# EAGLE design ecocar_CVM (EAGLE 7.7.0)
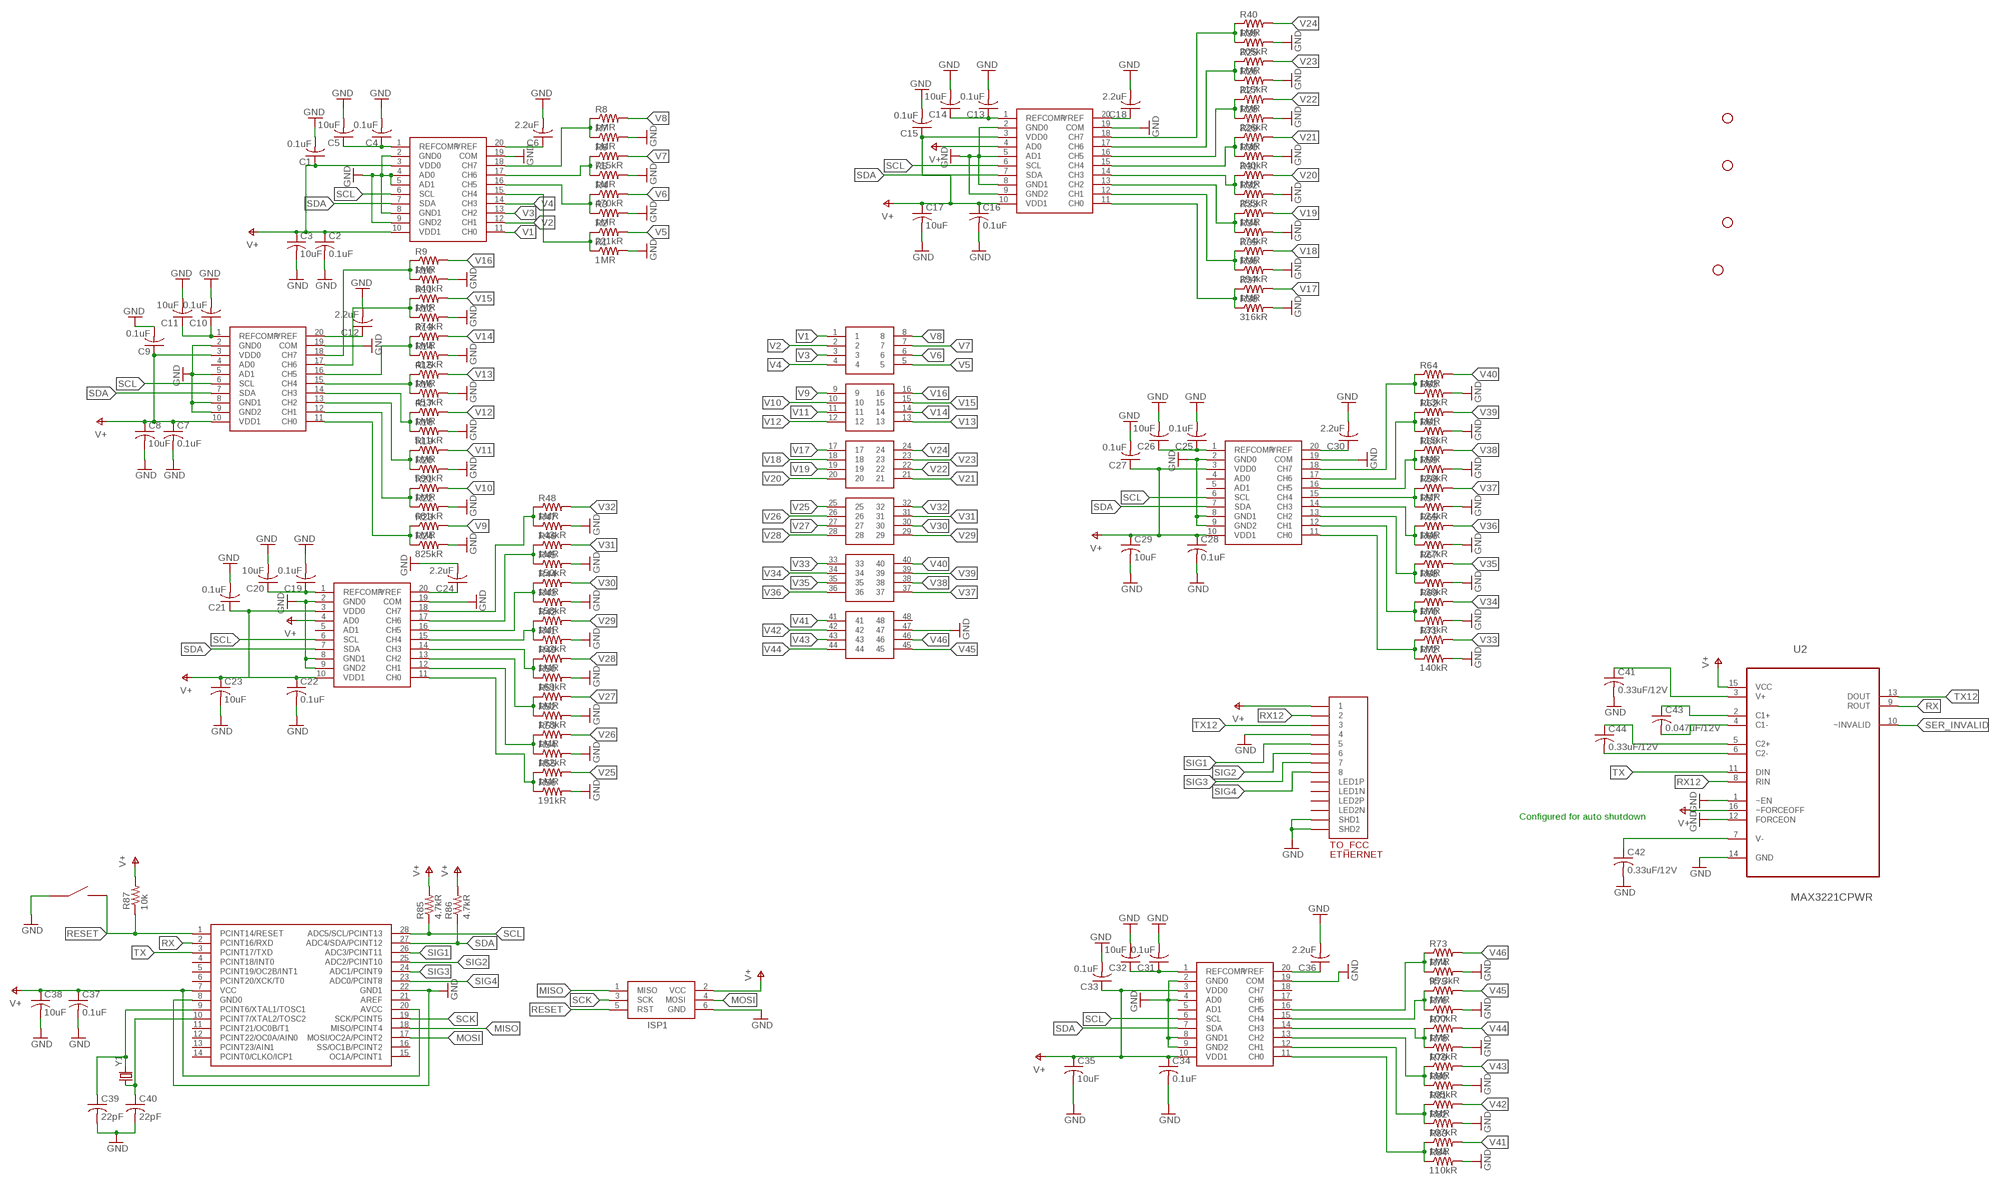
[diagram p0: schematic, sheet 1]

## Parts
0001000  LTC2309  LTC2309HF#PBF  [TSSOP20]
0001001  LTC2309  LTC2309HF#PBF  [TSSOP20]
0001010  LTC2309  LTC2309HF#PBF  [TSSOP20]
0001011  LTC2309  LTC2309HF#PBF  [TSSOP20]
0011000  LTC2309  LTC2309HF#PBF  [TSSOP20]
0011001  LTC2309  LTC2309HF#PBF  [TSSOP20]
C1  0.1uF  C-USC0805  [C0805]
C2  0.1uF  C-USC0805  [C0805]
C3  10uF  C-USC0805  [C0805]
C4  0.1uF  C-USC0805  [C0805]
C5  10uF  C-USC0805  [C0805]
C6  2.2uF  C-USC0805  [C0805]
C7  0.1uF  C-USC0805  [C0805]
C8  10uF  C-USC0805  [C0805]
C9  0.1uF  C-USC0805  [C0805]
C10  0.1uF  C-USC0805  [C0805]
C11  10uF  C-USC0805  [C0805]
C12  2.2uF  C-USC0805  [C0805]
C13  0.1uF  C-USC0805  [C0805]
C14  10uF  C-USC0805  [C0805]
C15  0.1uF  C-USC0805  [C0805]
C16  0.1uF  C-USC0805  [C0805]
C17  10uF  C-USC0805  [C0805]
C18  2.2uF  C-USC0805  [C0805]
C19  0.1uF  C-USC0805  [C0805]
C20  10uF  C-USC0805  [C0805]
C21  0.1uF  C-USC0805  [C0805]
C22  0.1uF  C-USC0805  [C0805]
C23  10uF  C-USC0805  [C0805]
C24  2.2uF  C-USC0805  [C0805]
C25  0.1uF  C-USC0805  [C0805]
C26  10uF  C-USC0805  [C0805]
C27  0.1uF  C-USC0805  [C0805]
C28  0.1uF  C-USC0805  [C0805]
C29  10uF  C-USC0805  [C0805]
C30  2.2uF  C-USC0805  [C0805]
C31  0.1uF  C-USC0805  [C0805]
C32  10uF  C-USC0805  [C0805]
C33  0.1uF  C-USC0805  [C0805]
C34  0.1uF  C-USC0805  [C0805]
C35  10uF  C-USC0805  [C0805]
C36  2.2uF  C-USC0805  [C0805]
C37  0.1uF  C-USC0805  [C0805]
C38  10uF  C-USC0805  [C0805]
C39  22pF  C-USC0805  [C0805]
C40  22pF  C-USC0805  [C0805]
C41  0.33uF/12V  C-USC0805  [C0805]
C42  0.33uF/12V  C-USC0805  [C0805]
C43  0.047uF/12V  C-USC0805  [C0805]
C44  0.33uF/12V  C-USC0805  [C0805]
ISP1  AVRISP-BOX  [AVRISP-BOX]
R1  1MR  R-US_R0805  [R0805]
R2  221kR  R-US_R0805  [R0805]
R3  1MR  R-US_R0805  [R0805]
R4  470kR  R-US_R0805  [R0805]
R5  1MR  R-US_R0805  [R0805]
R6  715kR  R-US_R0805  [R0805]
R7  1MR  R-US_R0805  [R0805]
R8  1MR  R-US_R0805  [R0805]
R9  1MR  R-US_R0805  [R0805]
R10  340kR  R-US_R0805  [R0805]
R11  1MR  R-US_R0805  [R0805]
R12  374kR  R-US_R0805  [R0805]
R13  1MR  R-US_R0805  [R0805]
R14  412kR  R-US_R0805  [R0805]
R15  1MR  R-US_R0805  [R0805]
R16  453kR  R-US_R0805  [R0805]
R17  1MR  R-US_R0805  [R0805]
R18  511kR  R-US_R0805  [R0805]
R19  1MR  R-US_R0805  [R0805]
R20  590kR  R-US_R0805  [R0805]
R21  1MR  R-US_R0805  [R0805]
R22  681kR  R-US_R0805  [R0805]
R23  1MR  R-US_R0805  [R0805]
R24  825kR  R-US_R0805  [R0805]
R25  1MR  R-US_R0805  [R0805]
R26  215kR  R-US_R0805  [R0805]
R27  1MR  R-US_R0805  [R0805]
R28  226kR  R-US_R0805  [R0805]
R29  1MR  R-US_R0805  [R0805]
R30  240kR  R-US_R0805  [R0805]
R31  1MR  R-US_R0805  [R0805]
R32  255kR  R-US_R0805  [R0805]
R33  1MR  R-US_R0805  [R0805]
R34  274kR  R-US_R0805  [R0805]
R35  1MR  R-US_R0805  [R0805]
R36  294kR  R-US_R0805  [R0805]
R37  1MR  R-US_R0805  [R0805]
R38  316kR  R-US_R0805  [R0805]
R39  205kR  R-US_R0805  [R0805]
R40  1MR  R-US_R0805  [R0805]
R41  162kR  R-US_R0805  [R0805]
R42  1MR  R-US_R0805  [R0805]
R43  158kR  R-US_R0805  [R0805]
R44  1MR  R-US_R0805  [R0805]
R45  150kR  R-US_R0805  [R0805]
R46  1MR  R-US_R0805  [R0805]
R47  143kR  R-US_R0805  [R0805]
R48  1MR  R-US_R0805  [R0805]
R49  1MR  R-US_R0805  [R0805]
R50  169kR  R-US_R0805  [R0805]
R51  1MR  R-US_R0805  [R0805]
R52  178kR  R-US_R0805  [R0805]
R53  1MR  R-US_R0805  [R0805]
R54  182kR  R-US_R0805  [R0805]
R55  1MR  R-US_R0805  [R0805]
R56  191kR  R-US_R0805  [R0805]
R57  124kR  R-US_R0805  [R0805]
R58  1MR  R-US_R0805  [R0805]
R59  120kR  R-US_R0805  [R0805]
R60  1MR  R-US_R0805  [R0805]
R61  115kR  R-US_R0805  [R0805]
R62  1MR  R-US_R0805  [R0805]
R63  113kR  R-US_R0805  [R0805]
R64  1MR  R-US_R0805  [R0805]
R65  1MR  R-US_R0805  [R0805]
R66  127kR  R-US_R0805  [R0805]
R67  1MR  R-US_R0805  [R0805]
R68  130kR  R-US_R0805  [R0805]
R69  1MR  R-US_R0805  [R0805]
R70  133kR  R-US_R0805  [R0805]
R71  1MR  R-US_R0805  [R0805]
R72  140kR  R-US_R0805  [R0805]
R73  1MR  R-US_R0805  [R0805]
R74  95.3kR  R-US_R0805  [R0805]
R75  1MR  R-US_R0805  [R0805]
R76  100kR  R-US_R0805  [R0805]
R77  1MR  R-US_R0805  [R0805]
R78  102kR  R-US_R0805  [R0805]
R79  1MR  R-US_R0805  [R0805]
R80  105kR  R-US_R0805  [R0805]
R81  1MR  R-US_R0805  [R0805]
R82  107kR  R-US_R0805  [R0805]
R83  1MR  R-US_R0805  [R0805]
R84  110kR  R-US_R0805  [R0805]
R85  4.7kR  R-US_R0805  [R0805]
R86  4.7kR  R-US_R0805  [R0805]
R87  10k  R-US_R0805  [R0805]
STANDOFF1  STAND-OFF  [STAND-OFF]
STANDOFF2  STAND-OFF  [STAND-OFF]
STANDOFF3  STAND-OFF  [STAND-OFF]
STANDOFF4  STAND-OFF  [STAND-OFF]
TO_FCC  ETHERNET  [A122645-ND]
U2  MAX3221CPWR  [SOP65P640X120-16N]
U$1  ATMEGA328P  [DIL28-3]
U$3  6-RJ45  6-RJ45-5557572-3  [48-PIN-THROUGHHOLE]
U$4  EG4621CT-ND  [EG4621CT-ND]
Y1  CRYSTALHC49US  [HC49US]

## Nets
GND: 0001000.2(GND0) 0001000.4(AD0) 0001000.5(AD1) 0001000.8(GND1) 0001000.9(GND2) 0001000.19(COM) 0001001.2(GND0) 0001001.5(AD1) 0001001.8(GND1) 0001001.9(GND2) 0001001.19(COM) 0001010.2(GND0) 0001010.5(AD1) 0001010.8(GND1) 0001010.9(GND2) 0001010.19(COM) 0001011.2(GND0) 0001011.8(GND1) 0001011.9(GND2) 0001011.19(COM) 0011000.2(GND0) 0011000.8(GND1) 0011000.9(GND2) 0011000.19(COM) 0011001.2(GND0) 0011001.4(AD0) 0011001.8(GND1) 0011001.9(GND2) 0011001.19(COM) C1.2 C2.2 C3.2 C4.2 C5.2 C6.2 C7.2 C8.2 C9.2 C10.2 C11.2 C12.2 C13.2 C14.2 C15.2 C16.2 C17.2 C18.2 C19.2 C20.2 C21.2 C22.2 C23.2 C24.2 C25.2 C26.2 C27.2 C28.2 C29.2 C30.2 C31.2 C32.2 C33.2 C34.2 C35.2 C36.2 C37.2 C38.2 C39.2 C40.2 C41.2 C42.2 ISP1.6(GND) R1.2 R3.2 R5.2 R7.2 R10.2 R12.2 R14.2 R16.2 R18.2 R20.2 R22.2 R24.2 R26.2 R28.2 R30.2 R32.2 R34.2 R36.2 R38.2 R39.2 R41.2 R43.2 R45.2 R47.2 R50.2 R52.2 R54.2 R56.2 R57.2 R59.2 R61.2 R63.2 R66.2 R68.2 R70.2 R72.2 R74.2 R76.2 R78.2 R80.2 R82.2 R84.2 TO_FCC.P$4 TO_FCC.P$13(SHD1) TO_FCC.P$14(SHD2) U2.1(~EN) U2.12(FORCEON) U2.14(GND) U$1.8(GND0) U$1.22(GND1) U$3.47 U$4.P$1 U$4.P$2
MISO: ISP1.1(MISO) U$1.18(MISO/PCINT4)
MOSI: ISP1.4(MOSI) U$1.17(MOSI/OC2A/PCINT2)
N$1: 0001000.1(REFCOMP) C4.1 C5.1
N$2: 0001000.20(VREF) C6.1
N$3: 0001001.11(CH0) R23.1 R24.1
N$4: 0001001.1(REFCOMP) C10.1 C11.1
N$5: 0001001.20(VREF) C12.1
N$6: 0001001.12(CH1) R21.1 R22.1
N$7: 0001000.15(CH4) R1.1 R2.1
N$8: 0001000.16(CH5) R3.1 R4.1
N$9: 0001000.17(CH6) R5.1 R6.1
N$10: 0001000.18(CH7) R7.1 R8.1
N$11: 0001001.13(CH2) R19.1 R20.1
N$12: 0001001.14(CH3) R17.1 R18.1
N$13: 0001001.15(CH4) R15.1 R16.1
N$14: 0001001.16(CH5) R13.1 R14.1
N$15: 0001001.17(CH6) R11.1 R12.1
N$16: 0001001.18(CH7) R9.1 R10.1
N$17: 0001010.1(REFCOMP) C13.1 C14.1
N$18: 0011000.1(REFCOMP) C25.1 C26.1
N$19: 0001010.11(CH0) R37.1 R38.1
N$20: 0001010.20(VREF) C18.1
N$21: 0001010.12(CH1) R35.1 R36.1
N$22: 0001010.13(CH2) R33.1 R34.1
N$23: 0001010.14(CH3) R31.1 R32.1
N$24: 0001010.15(CH4) R29.1 R30.1
N$25: 0001010.16(CH5) R27.1 R28.1
N$26: 0001010.17(CH6) R25.1 R26.1
N$27: 0001010.18(CH7) R39.1 R40.1
N$28: 0001011.1(REFCOMP) C19.1 C20.1
N$29: 0011001.1(REFCOMP) C31.1 C32.1
N$30: 0011001.20(VREF) C36.1
N$31: 0001011.20(VREF) C24.1
N$32: 0001011.11(CH0) R55.1 R56.1
N$33: 0001011.12(CH1) R53.1 R54.1
N$34: 0001011.13(CH2) R51.1 R52.1
N$35: 0001011.14(CH3) R49.1 R50.1
N$36: 0001011.15(CH4) R41.1 R42.1
N$37: 0001011.16(CH5) R43.1 R44.1
N$38: 0001011.17(CH6) R45.1 R46.1
N$39: 0001011.18(CH7) R47.1 R48.1
N$40: 0011000.20(VREF) C30.1
N$41: 0011000.11(CH0) R71.1 R72.1
N$42: 0011000.12(CH1) R69.1 R70.1
N$43: 0011000.13(CH2) R67.1 R68.1
N$44: 0011000.14(CH3) R65.1 R66.1
N$45: 0011000.15(CH4) R57.1 R58.1
N$46: 0011000.16(CH5) R59.1 R60.1
N$47: 0011000.17(CH6) R61.1 R62.1
N$48: 0011000.18(CH7) R63.1 R64.1
N$49: C39.1 U$1.9(PCINT6/XTAL1/TOSC1) Y1.2
N$50: C40.1 U$1.10(PCINT7/XTAL2/TOSC2) Y1.1
N$51: 0011001.11(CH0) R83.1 R84.1
N$52: 0011001.12(CH1) R81.1 R82.1
N$53: 0011001.13(CH2) R79.1 R80.1
N$54: 0011001.14(CH3) R77.1 R78.1
N$55: 0011001.15(CH4) R75.1 R76.1
N$56: 0011001.16(CH5) R73.1 R74.1
N$73: C41.1 U2.3(V+)
N$74: C43.1 U2.2(C1+)
N$75: C43.2 U2.4(C1-)
N$76: C44.1 U2.5(C2+)
N$77: C44.2 U2.6(C2-)
N$78: C42.1 U2.7(V-)
RESET: ISP1.5(RST) R87.1 U$1.1(PCINT14/RESET) U$4.P$3 U$4.P$4
RX: U2.9(ROUT) U$1.2(PCINT16/RXD)
RX12: TO_FCC.P$2 U2.8(RIN)
SCK: ISP1.3(SCK) U$1.19(SCK/PCINT5)
SCL: 0001000.6(SCL) 0001001.6(SCL) 0001010.6(SCL) 0001011.6(SCL) 0011000.6(SCL) 0011001.6(SCL) R85.1 U$1.28(ADC5/SCL/PCINT13)
SDA: 0001000.7(SDA) 0001001.7(SDA) 0001010.7(SDA) 0001011.7(SDA) 0011000.7(SDA) 0011001.7(SDA) R86.1 U$1.27(ADC4/SDA/PCINT12)
SER_INVALID: U2.10(~INVALID)
SIG1: TO_FCC.P$5 U$1.26(ADC3/PCINT11)
SIG2: TO_FCC.P$6 U$1.25(ADC2/PCINT10)
SIG3: TO_FCC.P$7 U$1.24(ADC1/PCINT9)
SIG4: TO_FCC.P$8 U$1.23(ADC0/PCINT8)
TX: U2.11(DIN) U$1.3(PCINT17/TXD)
TX12: TO_FCC.P$3 U2.13(DOUT)
V1: 0001000.11(CH0) U$3.1
V2: 0001000.12(CH1) U$3.2
V3: 0001000.13(CH2) U$3.3
V4: 0001000.14(CH3) U$3.4
V5: R2.2 U$3.5
V6: R4.2 U$3.6
V7: R6.2 U$3.7
V8: R8.2 U$3.8
V9: R23.2 U$3.9
V10: R21.2 U$3.10
V11: R19.2 U$3.11
V12: R17.2 U$3.12
V13: R15.2 U$3.13
V14: R13.2 U$3.14
V15: R11.2 U$3.15
V16: R9.2 U$3.16
V17: R37.2 U$3.17
V18: R35.2 U$3.18
V19: R33.2 U$3.19
V20: R31.2 U$3.20
V21: R29.2 U$3.21
V22: R27.2 U$3.22
V23: R25.2 U$3.23
V24: R40.2 U$3.24
V25: R55.2 U$3.25
V26: R53.2 U$3.26
V27: R51.2 U$3.27
V28: R49.2 U$3.28
V29: R42.2 U$3.29
V30: R44.2 U$3.30
V31: R46.2 U$3.31
V32: R48.2 U$3.32
V33: R71.2 U$3.33
V34: R69.2 U$3.34
V35: R67.2 U$3.35
V36: R65.2 U$3.36
V37: R58.2 U$3.37
V38: R60.2 U$3.38
V39: R62.2 U$3.39
V40: R64.2 U$3.40
V41: R83.2 U$3.41
V42: R81.2 U$3.42
V43: R79.2 U$3.43
V44: R77.2 U$3.44
V45: R75.2 U$3.45
V46: R73.2 U$3.46
V+: 0001000.3(VDD0) 0001000.10(VDD1) 0001001.3(VDD0) 0001001.10(VDD1) 0001010.3(VDD0) 0001010.4(AD0) 0001010.10(VDD1) 0001011.3(VDD0) 0001011.4(AD0) 0001011.10(VDD1) 0011000.3(VDD0) 0011000.10(VDD1) 0011001.3(VDD0) 0011001.10(VDD1) C1.1 C2.1 C3.1 C7.1 C8.1 C9.1 C15.1 C16.1 C17.1 C21.1 C22.1 C23.1 C27.1 C28.1 C29.1 C33.1 C34.1 C35.1 C37.1 C38.1 ISP1.2(VCC) R85.2 R86.2 R87.2 TO_FCC.P$1 U2.15(VCC) U2.16(~FORCEOFF) U$1.7(VCC) U$1.20(AVCC)
Unconnected: 0001001.4(AD0) 0001011.5(AD1) 0011000.4(AD0) 0011000.5(AD1) 0011001.5(AD1) 0011001.17(CH6) 0011001.18(CH7) TO_FCC.P$9(LED1N) TO_FCC.P$10(LED1P) TO_FCC.P$11(LED2N) TO_FCC.P$12(LED2P) U$1.4(PCINT18/INT0) U$1.5(PCINT19/OC2B/INT1) U$1.6(PCINT20/XCK/T0) U$1.11(PCINT21/OC0B/T1) U$1.12(PCINT22/OC0A/AIN0) U$1.13(PCINT23/AIN1) U$1.14(PCINT0/CLKO/ICP1) U$1.15(OC1A/PCINT1) U$1.16(SS/OC1B/PCINT2) U$1.21(AREF) U$3.48

## Notes on the sheet
- Configured for auto shutdown

## Library data of the parts
0001000 0001001 0001010 0001011 0011000 0011001 = linear-technology:LTC2309HF#PBF
C1-C40 = rcl:C-US: CAPACITOR, American symbol
C41-C44 = E-P-008-R1.2:C-US: CAPACITOR, American symbol
ISP1 = adafruit:AVRISP: AVR ISP HEADER Standard 6 pin header for AVR programming
R1-R87 = rcl:R-US_: RESISTOR, American symbol
STANDOFF1-STANDOFF4 = SparkFun-Electromechanical:STAND-OFF: #4 Stand Off This is the mechanical footprint for a #4 phillips button head screw. Use the keepout ring to avoid running the screw head into surrounding components. SKU : PRT-00447
TO_FCC = ETHERNET:ETHERNET: Ethernet port with 2 leds. digikey number A122645-ND
U2 = Texas Instruments_By_element14_Batch_1:MAX3221CPWR: RS-232 Line Driver/Receiver; MPN: MAX3221CPWR; OC_FARNELL: -; OC_NEWARK: 75C0980; PACKAGE: TSSOP-16; SUPPLIER: Texas Instruments
U$1 = atmel:ATMEGA328P
U$3 = rj45:6-RJ45-5557572-3
U$4 = EG4621CT-ND:EG4621CT-ND: surface mount push putton digikey number EG4621CT-ND
Y1 = SparkFun-FreqCtrl:CRYSTAL: Various standard crystals. Proven footprints.

## Board
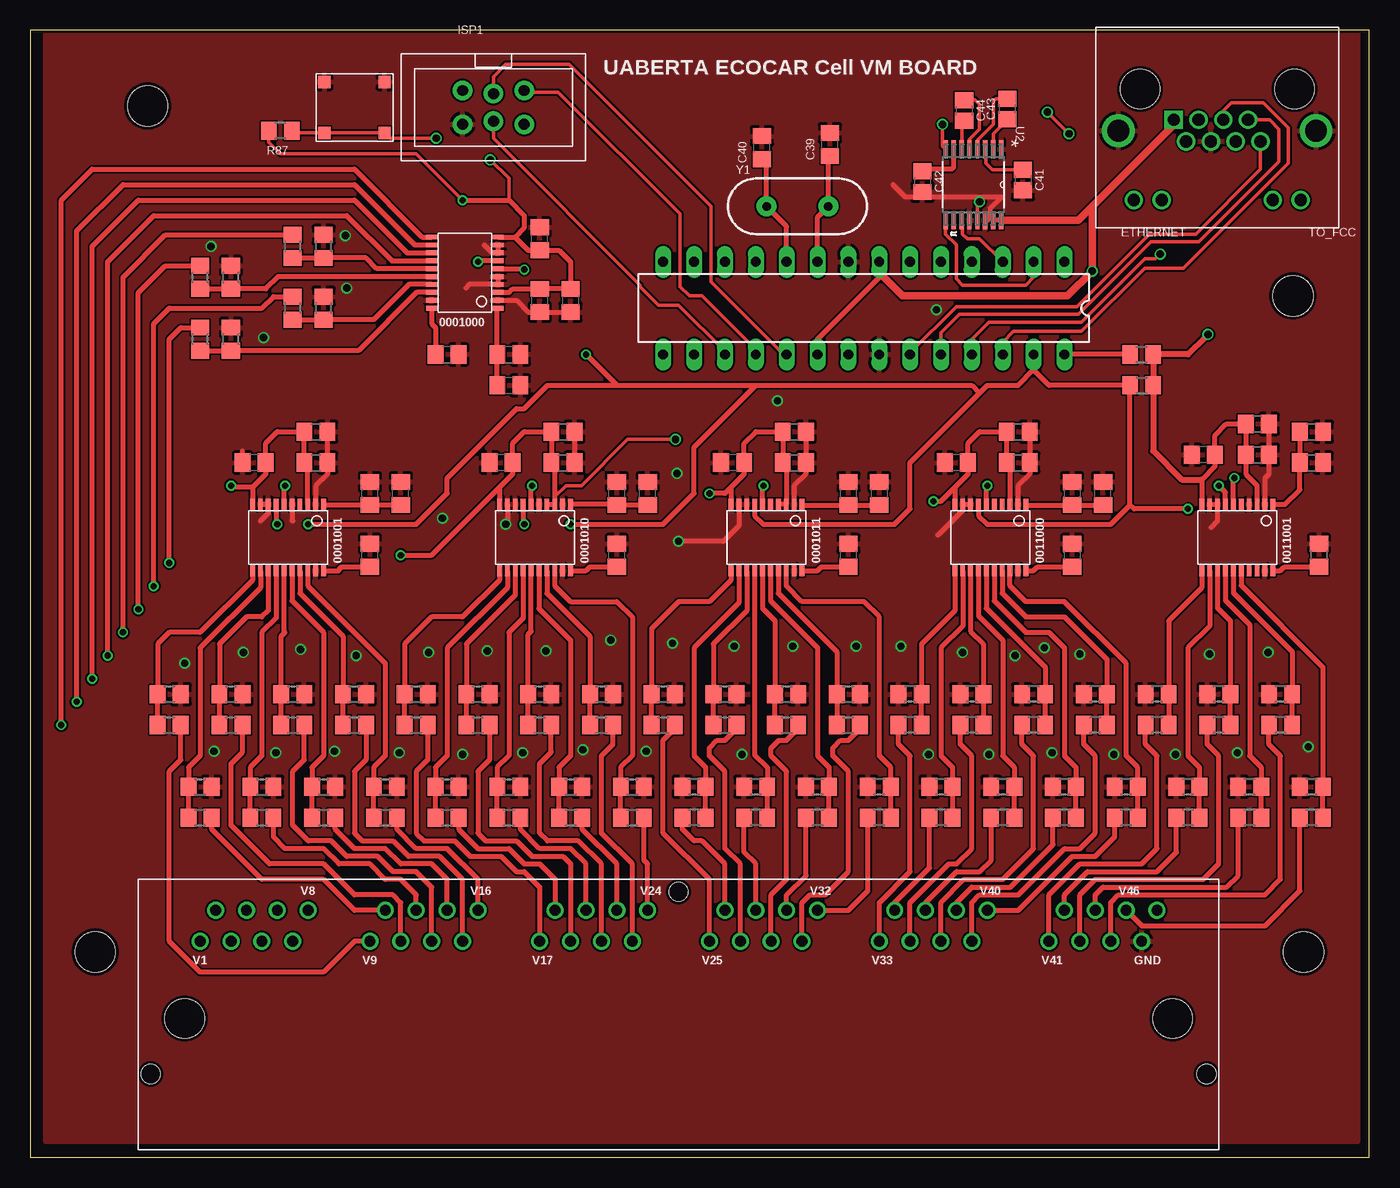
[diagram p1: board, top side]
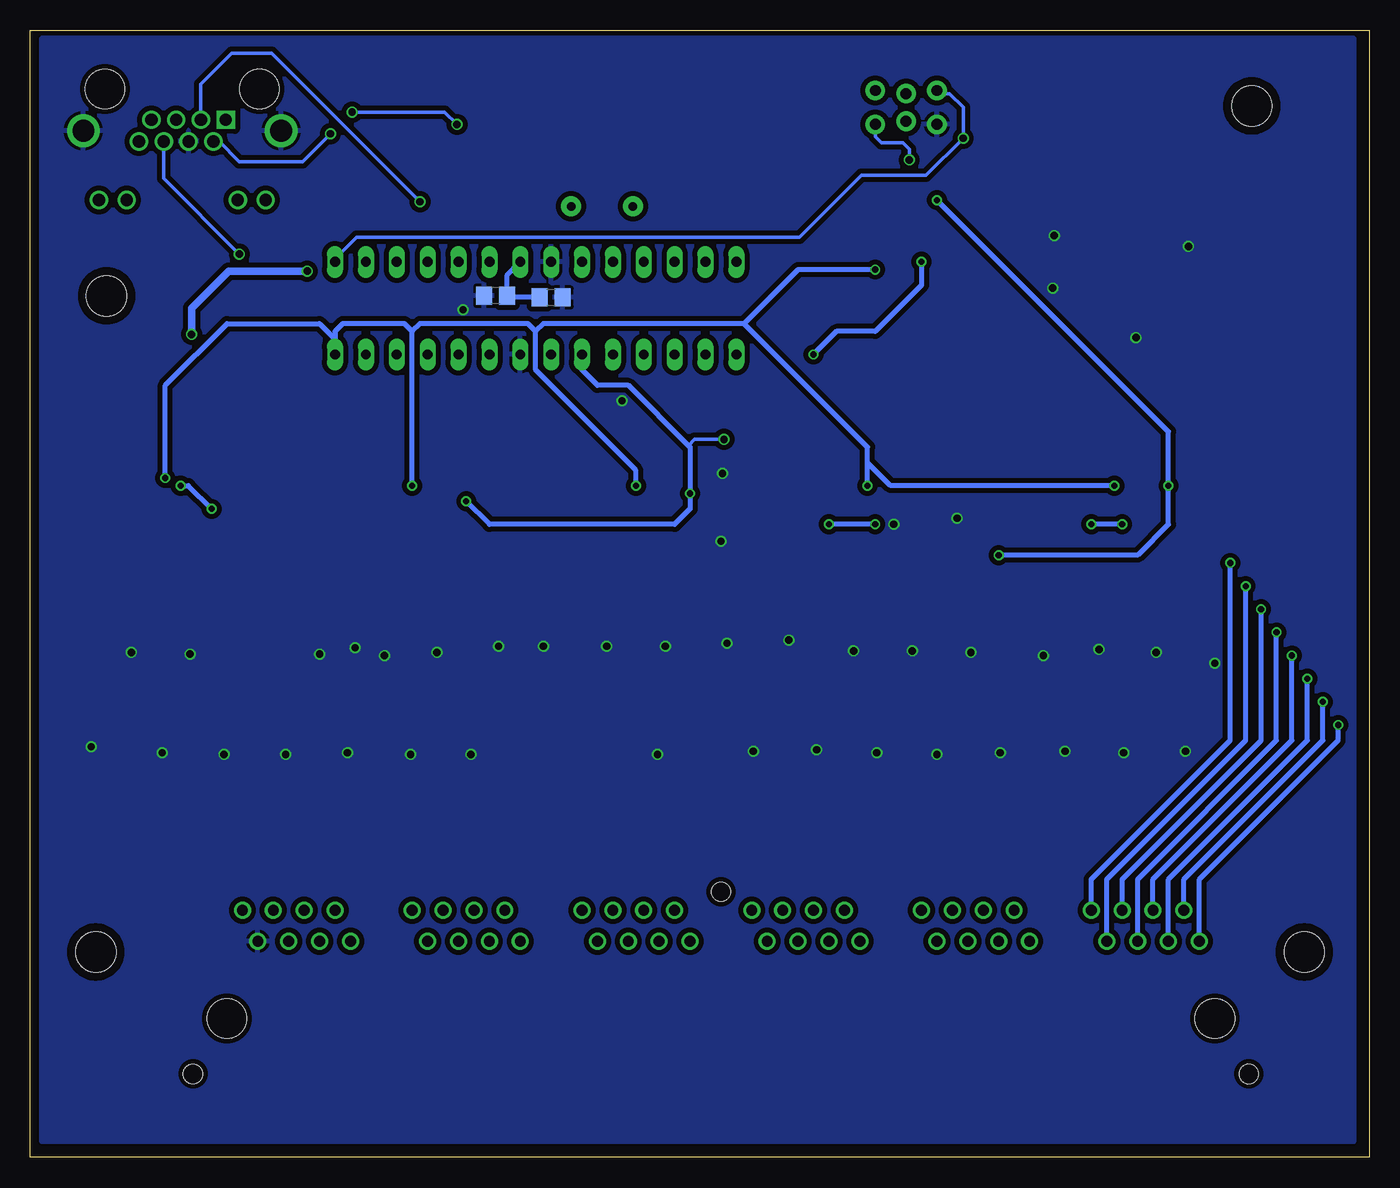
[diagram p2: board, bottom side, seen from below]

Size 110.16 x 92.7 mm. Coordinates in mm from the lower left corner, seen from the top.
Outline: 0,0 110.16,0 110.16,92.7 0,92.7 0,0
Copper layers (1*16): Top 0.035mm / dielectric 1.5mm / Bottom 0.035mm
Design rules "SeeedStudio_2layer_DRU_no_angle_20140221": minimum track width 6mil, minimum drill 12mil, track to track 6mil, track to pad 6mil, pad to pad 6mil, via to via 6mil, smd to smd 0mil, copper to edge 10mil, drill to drill 10mil, minimum pad ring 10mil, minimum via ring 6mil, stop-mask expansion 2mil, vias tented up to drill 100mil, thermal gap 10mil

### Footprints (pad centres in the part's own frame; a part is rotated, then mirrored left to right if it is on the bottom)
TSSOP20 = smd 0.4 x 0.95: 1 0,-5.45; 2 0.65,-5.45; 3 1.3,-5.45; 4 1.95,-5.45; 5 2.6,-5.45; 6 3.25,-5.45; 7 3.9,-5.45; 8 4.55,-5.45; 9 5.2,-5.45; 10 5.85,-5.45; 11 5.85,0; 12 5.2,0; 13 4.55,0; 14 3.9,0; 15 3.25,0; 16 2.6,0; 17 1.95,0; 18 1.3,0; 19 0.65,0; 20 0,0
C0805 = smd 1.3 x 1.5: 1 -0.95,0; 2 0.95,0
C0805' = smd 1.3 x 1.5: 1 -0.85,0; 2 0.85,0
AVRISP-BOX = drill 0.9 pad 1.626: 1 -1.397,2.54; 2 1.397,2.54; 3 -1.143,0; 4 1.143,0; 5 -1.397,-2.54; 6 1.397,-2.54
R0805 = smd 1.3 x 1.5: 1 -0.95,0; 2 0.95,0
STAND-OFF = hole 3.302: 0,0
A122645-ND = drill 1 square: P$1 3.58,2.54 | drill 1: P$2 2.56,4.32; P$3 1.54,2.54; P$4 0.52,4.32; P$5 -0.5,2.54; P$6 -1.52,4.32; P$7 -2.54,2.54; P$8 -3.56,4.32; P$9 -6.86,9.14; P$10 -4.57,9.14; P$11 4.57,9.14; P$12 6.86,9.14 | drill 1.8: P$13 -8.13,3.43; P$14 8.13,3.43 | hole 3.25: -6.35,0; 6.35,0
SOP65P640X120-16N = smd 1.473 x 0.356: 1 -2.921,2.286; 2 -2.921,1.626; 3 -2.921,0.965; 4 -2.921,0.33; 5 -2.921,-0.33; 6 -2.921,-0.965; 7 -2.921,-1.626; 8 -2.921,-2.286; 9 2.921,-2.286; 10 2.921,-1.626; 11 2.921,-0.965; 12 2.921,-0.33; 13 2.921,0.33; 14 2.921,0.965; 15 2.921,1.626; 16 2.921,2.286
DIL28-3 = drill 0.813 long: 1 -16.51,-3.81; 2 -13.97,-3.81; 3 -11.43,-3.81; 4 -8.89,-3.81; 5 -6.35,-3.81; 6 -3.81,-3.81; 7 -1.27,-3.81; 8 1.27,-3.81; 9 3.81,-3.81; 10 6.35,-3.81; 11 8.89,-3.81; 12 11.43,-3.81; 13 13.97,-3.81; 14 16.51,-3.81; 15 16.51,3.81; 16 13.97,3.81; 17 11.43,3.81; 18 8.89,3.81; 19 6.35,3.81; 20 3.81,3.81; 21 1.27,3.81; 22 -1.27,3.81; 23 -3.81,3.81; 24 -6.35,3.81; 25 -8.89,3.81; 26 -11.43,3.81; 27 -13.97,3.81; 28 -16.51,3.81
48-PIN-THROUGHHOLE = drill 0.889: 1 1.27,6.35; 2 2.54,8.89; 3 3.81,6.35; 4 5.08,8.89; 5 6.35,6.35; 6 7.62,8.89; 7 8.89,6.35; 8 10.16,8.89; 9 15.24,6.35; 10 16.51,8.89; 11 17.78,6.35; 12 19.05,8.89; 13 20.32,6.35; 14 21.59,8.89; 15 22.86,6.35; 16 24.13,8.89; 17 29.21,6.35; 18 30.48,8.89; 19 31.75,6.35; 20 33.02,8.89; 21 34.29,6.35; 22 35.56,8.89; 23 36.83,6.35; 24 38.1,8.89; 25 43.18,6.35; 26 44.45,8.89; 27 45.72,6.35; 28 46.99,8.89; 29 48.26,6.35; 30 49.53,8.89; 31 50.8,6.35; 32 52.07,8.89; 33 57.15,6.35; 34 58.42,8.89; 35 59.69,6.35; 36 60.96,8.89; 37 62.23,6.35; 38 63.5,8.89; 39 64.77,6.35; 40 66.04,8.89; 41 71.12,6.35; 42 72.39,8.89; 43 73.66,6.35; 44 74.93,8.89; 45 76.2,6.35; 46 77.47,8.89; 47 78.74,6.35; 48 80.01,8.89 | hole 3.25: 0,0; 81.28,0 | hole 1.57: 40.64,10.414; -2.794,-4.572; 84.074,-4.572
EG4621CT-ND = smd 1 x 1: P$1 -2.475,2.1; P$2 2.475,2.1; P$3 -2.475,-2.1; P$4 2.475,-2.1
HC49US = drill 0.7 pad 1.651: 1 -2.54,0; 2 2.54,0

### Placement (x,y rotation side)
0001000  33.02,69.85 90 top
0001001  24.13,48.26 180 top
0001010  44.45,48.26 180 top
0001011  63.5,48.26 180 top
0011000  81.92,48.26 180 top
0011001  102.23,48.26 180 top
C1  41.91,70.48 270 top
C2  41.91,75.56 90 top
C3  44.45,70.48 270 top
C4  39.37,66.04 0 top
C5  39.37,63.5 0 top
C6  34.29,66.04 0 top
C7  23.5,57.15 0 top
C8  23.5,59.69 0 top
C9  18.41,57.15 180 top
C10  27.94,54.61 90 top
C11  30.48,54.61 90 top
C12  27.94,49.53 90 top
C13  48.26,54.61 90 top
C14  50.8,54.61 90 top
C15  43.81,57.15 0 top
C16  38.73,57.15 180 top
C17  43.81,59.69 0 top
C18  48.26,49.53 90 top
C19  67.31,54.61 90 top
C20  69.85,54.61 90 top
C21  57.78,57.15 180 top
C22  62.87,57.15 0 top
C23  62.87,59.69 0 top
C24  67.31,49.53 90 top
C25  85.72,54.61 90 top
C26  88.27,54.61 90 top
C27  76.2,57.15 180 top
C28  81.28,57.15 0 top
C29  81.28,59.69 0 top
C30  85.72,49.53 90 top
C31  105.41,57.15 0 top
C32  105.41,59.69 0 top
C33  100.97,57.78 0 top
C34  96.52,57.78 180 top
C35  100.97,60.33 0 top
C36  106.05,49.53 90 top
C37  71.88,70.87 180 bottom
C38  67.31,70.74 0 bottom
C39  65.79,83.31 90 top
C40  60.2,83.06 90 top
C41  0.33uF/12V  [C0805']  81.66,80.39 270 top
C42  0.33uF/12V  [C0805']  73.41,80.26 270 top
C43  0.047uF/12V  [C0805']  80.39,86.23 90 top
C44  0.33uF/12V  [C0805']  76.83,86.11 270 top
ISP1  38.1,86.36 270 top
R1  24.13,74.93 90 top
R2  21.59,74.93 90 top
R3  16.51,72.39 90 top
R4  13.97,72.39 90 top
R5  24.13,69.85 90 top
R6  21.59,69.85 90 top
R7  16.51,67.31 90 top
R8  13.97,67.31 90 top
R9  29.21,27.94 0 top
R10  29.21,30.48 0 top
R11  26.67,35.56 0 top
R12  26.67,38.1 0 top
R13  24.13,27.94 0 top
R14  24.13,30.48 0 top
R15  21.59,35.56 0 top
R16  21.59,38.1 0 top
R17  19.05,27.94 0 top
R18  19.05,30.48 0 top
R19  16.51,35.56 0 top
R20  16.51,38.1 0 top
R21  13.97,27.94 0 top
R22  13.97,30.48 0 top
R23  11.43,35.56 0 top
R24  11.43,38.1 0 top
R25  46.99,35.56 0 top
R26  46.99,38.1 0 top
R27  44.45,27.94 0 top
R28  44.45,30.48 0 top
R29  41.91,35.56 0 top
R30  41.91,38.1 0 top
R31  39.37,27.94 0 top
R32  39.37,30.48 0 top
R33  36.83,35.56 0 top
R34  36.83,38.1 0 top
R35  34.29,27.94 0 top
R36  34.29,30.48 0 top
R37  31.75,35.56 0 top
R38  31.75,38.1 0 top
R39  49.53,30.48 0 top
R40  49.53,27.94 0 top
R41  62.23,38.1 0 top
R42  62.23,35.56 0 top
R43  64.77,30.48 180 top
R44  64.77,27.94 180 top
R45  67.31,38.1 0 top
R46  67.31,35.56 0 top
R47  69.85,30.48 180 top
R48  69.85,27.94 180 top
R49  59.69,27.94 180 top
R50  59.69,30.48 180 top
R51  57.15,35.56 0 top
R52  57.15,38.1 0 top
R53  54.61,27.94 180 top
R54  54.61,30.48 180 top
R55  52.07,35.56 0 top
R56  52.07,38.1 0 top
R57  82.55,38.1 180 top
R58  82.55,35.56 180 top
R59  85.09,30.48 180 top
R60  85.09,27.94 180 top
R61  87.63,38.1 180 top
R62  87.63,35.56 180 top
R63  90.17,30.48 180 top
R64  90.17,27.94 180 top
R65  80.01,27.94 180 top
R66  80.01,30.48 180 top
R67  77.47,35.56 180 top
R68  77.47,38.1 180 top
R69  74.93,27.94 180 top
R70  74.93,30.48 180 top
R71  72.39,35.56 180 top
R72  72.39,38.1 180 top
R73  105.41,27.94 180 top
R74  105.41,30.48 180 top
R75  102.87,35.56 180 top
R76  102.87,38.1 180 top
R77  100.33,27.94 180 top
R78  100.33,30.48 180 top
R79  97.79,35.56 180 top
R80  97.79,38.1 180 top
R81  95.25,27.94 180 top
R82  95.25,30.48 180 top
R83  92.71,35.56 180 top
R84  92.71,38.1 180 top
R85  91.44,66.04 0 top
R86  91.44,63.5 0 top
R87  20.57,84.45 180 top
STANDOFF1  5.33,16.89 0 top
STANDOFF2  104.78,16.89 0 top
STANDOFF3  103.89,70.87 0 top
STANDOFF4  9.65,86.49 0 top
TO_FCC  97.66,87.88 180 top
U2  77.6,80.01 270 top
U$1  68.58,69.85 180 top
U$3  12.7,11.43 0 top
U$4  26.67,86.36 0 top
Y1  63.12,78.23 0 top

### Tracks (layer width: path | path; a pad name or v marks a point on that pad's centre or on a via)
GND  (via drill 0.6)
  Top 0.406: 0001000.2 39.99,70.5 40.95,69.53 C1.2 C3.2 | 0001000.9 0001000.8 37.99,74.4 37.34,75.06 | 0001000.5 0001000.4 36.11,71.8 35.81,71.5 | C8.2 C7.2 24.45,56.2 23.48,55.23 0001001.2 | C9.2 17.46,58.1 | 0001001.9 0001001.8 | C17.2 C15.2 | C23.2 C22.2 63.81,56.2 62.85,55.23 0001011.2 | C29.2 C28.2 82.23,56.2 81.27,55.23 0011000.2 | 0011000.8 0011000.9 76.72,53.22 74.68,51.18 | C35.2 C33.2 101.92,56.2 101.58,55.87 0011001.2 | 0011001.9 0011001.8 97.69,52.35 97.16,51.82 | 0001010.9 39.25,52.2 v39.12,52.07 | 0001011.9 58.3,53.84 58.29,53.85 58.29,51.94 57.02,50.67 v53.34,50.67 | 0001001.5 21.53,52.38 21.59,52.32 | 0001001.8 0001001.9 | 0001001.8 19.58,52.98 18.92,52.32 | U2.14 78.74,77.09 78.99,77.34 78.99,78.11 79.88,78.99 72.01,78.99 70.99,80.01 | C42.2 73.41,79.5
  other vias: 12.7,40.64 17.53,41.53 22.23,41.78 26.8,41.27 32.77,41.53 37.59,41.66 42.42,41.66 47.75,42.55 52.83,42.29 57.91,42.04 62.74,42.04 67.94,42.04 71.63,42.04 76.71,41.53 81.03,41.27 83.44,41.91 86.36,41.4 97.03,41.4 101.85,41.53 105.16,33.78 99.31,33.27 94.23,33.15 89.15,33.15 84.07,33.27 78.87,33.15 73.91,33.15 58.55,33.15 50.67,33.4 45.47,33.53 40.51,33.27 35.56,33.15 30.35,33.27 25.02,33.4 20.19,33.27 15.11,33.4 74.55,69.72 19.18,67.44 25.91,75.82 26.04,71.5 14.86,74.93 61.47,62.23 53.21,56.26 33.91,52.58
  pour Bottom (isolate 0.406): 1.27,1.27 109.22,1.27 109.22,92.08 1.27,92.08
  pour Top (rank 2): 1.27,1.27 1.27,92.71 109.22,92.71 109.22,1.27
MISO
  Top 0.305: U$1.18 59.69,66.42 55.24,70.87 54.23,70.87 53.47,71.63 53.47,77.6 43.43,87.63 40.77,87.63 ISP1.1
MOSI
  Top 0.305: U$1.17 57.15,66.29 53.34,70.1 51.69,70.1 50.16,71.63 50.16,71.75 38.1,83.82 ISP1.4
N$1
  Top 0.406: C5.1 C4.1 38.42,69.8 0001000.1
N$2
  Top 0.406: 0001000.20 33.02,68.58 33.34,68.26 C6.1
N$3
  Top 0.406: R23.1 R24.1 10.48,42.23 11.43,43.18 13.97,43.18 18.28,47.49 0001001.11
N$4
  Top 0.406: C11.1 C10.1 24.18,53.66 0001001.1
N$5
  Top 0.406: 0001001.20 25.4,48.26 arc-90 25.72,48.58 C12.1
N$6
  Top 0.406: R21.1 R22.1 13.02,32.07 13.97,33.02 13.97,41.91 18.93,46.87 0001001.12
N$7
  Top 0.406: R2.1 R1.1 27.62,73.98 28.5,73.1 0001000.15
N$8
  Top 0.406: R4.1 R3.1 19.37,71.44 20.38,72.45 0001000.16
N$9
  Top 0.406: R6.1 R5.1 28.26,68.9 31.16,71.8 0001000.17
N$10
  Top 0.406: R8.1 R7.1 26.99,66.36 31.78,71.15 0001000.18
N$11
  Top 0.406: R19.1 R20.1 15.56,42.23 17.78,44.45 19.05,44.45 19.58,44.98 0001001.13
N$12
  Top 0.406: R17.1 R18.1 18.1,32.07 19.05,33.02 19.05,43.18 20.23,44.36 0001001.14
N$13
  Top 0.406: R15.1 R16.1 20.64,42.87 20.95,43.18 20.88,43.26 0001001.15
N$14
  Top 0.406: R13.1 R14.1 23.18,32.07 24.13,33.02 24.13,43.18 21.53,45.78 0001001.16
N$15
  Top 0.406: R11.1 R12.1 25.72,42.86 22.18,46.4 0001001.17
N$16
  Top 0.406: R9.1 R10.1 28.26,32.07 29.21,33.02 29.21,40.64 22.83,47.02 0001001.18
N$17
  Top 0.406: C14.1 C13.1 48.21,53.71 0001010.1
N$18
  Top 0.406: 0011000.1 81.97,53.66 C25.1 C26.1
N$19
  Top 0.406: 0001010.11 38.6,47.49 35.56,44.45 33.02,44.45 30.8,42.23 R38.1 R37.1
N$20
  Top 0.406: 0001010.20 45.72,48.26 46.04,48.58 C18.1
N$21
  Top 0.406: R35.1 R36.1 33.34,32.07 34.29,33.02 34.29,41.91 39.25,46.87 0001010.12
N$22
  Top 0.406: R33.1 R34.1 35.88,42.23 39.9,46.25 0001010.13
N$23
  Top 0.406: R31.1 R32.1 38.42,32.07 39.37,33.02 39.37,43.18 40.55,44.36 0001010.14
N$24
  Top 0.406: R29.1 R30.1 40.96,43.02 41.2,43.26 0001010.15
N$25
  Top 0.406: R27.1 R28.1 43.5,32.07 44.45,33.02 44.45,42.55 41.85,45.15 0001010.16
N$26
  Top 0.406: R25.1 R26.1 46.04,42.86 42.5,46.4 0001010.17
N$27
  Top 0.406: R40.1 R39.1 48.58,32.07 49.53,33.02 49.53,44.45 48.26,45.72 44.45,45.72 43.15,47.02 0001010.18
N$28
  Top 0.406: 0001011.1 63.55,53.66 C19.1 C20.1
N$29
  Top 0.406: 0011001.1 103.24,53.71 104.46,54.93 C31.1 C32.1
N$30
  Top 0.406: 0011001.20 102.87,48.26 103.19,48.58 C36.1
N$31
  Top 0.406: 0001011.20 64.77,48.26 65.09,48.58 C24.1
N$32
  Top 0.406: R55.1 R56.1 51.12,43.5 53.34,45.72 55.88,45.72 57.65,47.49 0001011.11
N$33
  Top 0.406: R53.1 R54.1 55.56,32.07 54.61,33.02 54.61,41.91 58.3,45.6 0001011.12
N$34
  Top 0.406: R51.1 R52.1 56.2,42.23 58.95,44.98 0001011.13
N$35
  Top 0.406: R49.1 R50.1 60.64,32.07 59.6,33.11 0001011.14
N$36
  Top 0.406: R42.1 R41.1 61.28,44.13 60.25,45.16 0001011.15
N$37
  Top 0.406: R44.1 R43.1 65.72,32.07 64.77,33.02 64.77,41.91 60.9,45.78 0001011.16
N$38
  Top 0.406: 0001011.17 61.55,46.4 66.36,41.59 R45.1 R46.1
N$39
  Top 0.406: R48.1 R47.1 70.8,32.07 69.85,33.02 69.85,44.45 68.58,45.72 63.5,45.72 62.2,47.02 0001011.18
N$40
  Top 0.406: 0011000.20 82.55,48.26 82.87,48.58 C30.1
N$41
  Top 0.406: R71.1 R72.1 73.34,42.23 76.06,44.95 0011000.11
N$42
  Top 0.406: R69.1 R70.1 75.88,32.07 74.93,33.02 74.93,41.91 76.72,43.7 0011000.12
N$43
  Top 0.406: 0011000.13 77.36,43.28 78.42,42.23 R68.1 R67.1
N$44
  Top 0.406: R65.1 R66.1 80.96,32.07 80.01,33.02 80.01,42.55 78.02,44.54 0011000.14
N$45
  Top 0.406: R58.1 R57.1 83.5,40.33 78.67,45.16 0011000.15
N$46
  Top 0.406: R60.1 R59.1 86.04,32.07 85.09,33.02 85.09,41.91 83.82,43.18 81.92,43.18 79.31,45.78 0011000.16
N$47
  Top 0.406: R62.1 R61.1 88.58,40.96 85.09,44.45 81.92,44.45 79.97,46.4 0011000.17
N$48
  Top 0.406: R64.1 R63.1 91.12,32.07 90.17,33.02 90.17,40.64 85.09,45.72 81.92,45.72 80.61,47.02 0011000.18
N$49
  Top 0.406: C39.1 65.66,82.23 Y1.2 64.77,77.34 U$1.9
N$50
  Top 0.406: C40.1 60.58,81.73 Y1.1 62.23,76.58 U$1.10
N$51
  Top 0.406: 0011001.11 96.39,46.85 93.66,44.13 R84.1 R83.1
N$52
  Top 0.406: R81.1 R82.1 96.2,32.07 95.25,33.02 95.25,41.91 97.03,43.7 0011001.12
N$53
  Top 0.406: R79.1 R80.1 98.74,44.13 97.69,45.19 0011001.13
N$54
  Top 0.406: R77.1 R78.1 101.28,32.07 100.33,33.02 100.33,43.81 98.33,45.81 0011001.14
N$55
  Top 0.406: R75.1 R76.1 103.82,41.59 98.98,46.43 0011001.15
N$56
  Top 0.406: R73.1 R74.1 106.36,40.33 99.64,47.05 0011001.16
N$73
  Top 0.305: C41.1 79.16,81.24 78.61,81.79 78.61,82.88 U2.3
N$74
  Top 0.305: U2.2 79.22,84.22 C43.1
N$75
  Top 0.305: C43.2 79.46,87.08 79.25,86.87 79.25,84.96 77.98,83.69 77.98,82.98 U2.4
N$76
  Top 0.305: U2.5 77.27,83.74 78.11,84.58 78.11,86.61 77.72,87 76.87,87 C44.1
N$77
  Top 0.305: U2.6 76.63,85.05 C44.2
N$78
  Top 0.406: U2.7 75.97,81.43 75.82,81.28 73.57,81.28 C42.1
RESET  (via drill 0.6)
  Top 0.305: v33.4,83.82 29.59,83.82 U$4.P$4 U$4.P$3 21.72,84.26 R87.1
  Bottom 0.305: U$1.1 85.09,73.91 83.31,75.69 46.86,75.69 41.78,80.77 36.45,80.77 v33.4,83.82 33.4,86.36 34.54,87.5 35.31,87.5 ISP1.5
RX
  Top 0.305: U$1.2 82.55,72.39 81.92,71.75 76.71,71.75 76.2,72.26 76.2,75.06 75.31,75.95 U2.9
RX12  (via drill 0.6)
  Top 0.305: v85.47,84.2 v83.69,85.98 | v75.06,84.96 75.06,83.19 U2.8
  Bottom 0.305: TO_FCC.P$2 94.61,83.56 92.96,81.92 87.76,81.92 v85.47,84.2 | v83.69,85.98 76.07,85.98 v75.06,84.96
SCK
  Top 0.305: U$1.19 61.98,66.04 56.01,72.01 56.01,78.23 44.32,89.92 39.12,89.92 38.1,88.9 ISP1.3
SCL  (via drill 0.51)
  Top 0.406: R85.1 U$1.28 | 0011000.6 78.67,55.17 v78.74,55.24 | 0011001.6 98.98,55.8 v99.06,55.88 | 0001011.6 60.25,55.17 v60.33,55.24 | 0001010.6 41.2,55.17 v41.27,55.24 | 0001000.6 40.56,73.1 v40.64,73.03 | 0001001.6 20.88,55.17 v20.95,55.24
  Bottom 0.406: v78.74,55.24 78.74,67.94 | 78.74,67.94 79.38,68.58 84.45,68.58 85.09,67.94 85.09,67.31 | 85.09,67.31 U$1.28 | v99.06,55.88 99.06,63.5 93.98,68.58 86.36,68.58 85.09,67.31 | v60.33,55.24 60.33,56.52 68.58,64.77 68.58,67.94 | 68.58,67.94 69.22,68.58 78.11,68.58 78.74,67.94 | v41.27,55.24 41.27,57.15 | 41.27,57.15 41.27,58.42 51.44,68.58 | 51.44,68.58 67.94,68.58 68.58,67.94 | v40.64,73.03 46.99,73.03 51.44,68.58 | v20.95,55.24 39.37,55.24 41.27,57.15
SDA  (via drill 0.51)
  Top 0.406: 82.55,64.77 83.82,63.5 R86.1 90.49,53.66 | 82.55,64.77 U$1.27 | 0011000.7 78.02,52.8 78.74,52.07 88.9,52.07 90.49,53.66 | 0011001.7 98.33,54.7 v97.79,55.24 | v95.25,53.34 90.81,53.34 90.49,53.66 | 0001011.7 59.6,52.8 60.33,52.07 71.12,52.07 72.39,53.34 72.39,57.15 78.11,62.87 | 78.11,62.87 78.74,63.5 81.28,63.5 82.55,64.77 | 0001010.7 40.55,52.16 v40.64,52.07 | v44.45,52.07 52.07,52.07 54.61,54.61 54.61,58.42 59.69,63.5 | 59.69,63.5 77.47,63.5 78.11,62.87 | 0001000.7 36.92,73.75 v36.83,73.66 | v45.72,66.04 48.26,63.5 | 48.26,63.5 59.69,63.5 | 0001001.7 20.23,52.16 v20.32,52.07 | v22.86,52.07 31.75,52.07 34.29,54.61 34.29,55.88 40.01,61.59 40.64,61.59 42.55,63.5 48.26,63.5
  Bottom 0.406: v97.79,55.24 97.16,55.24 v95.25,53.34 | v40.64,52.07 v44.45,52.07 | v36.83,73.66 36.83,71.75 40.64,67.94 43.81,67.94 v45.72,66.04 | v20.32,52.07 v22.86,52.07
SIG1
  Top 0.305: U$1.26 80.01,67.06 80.9,67.94 86.49,67.94 91.69,73.15 94.87,73.15 103.5,81.79 103.5,84.71 101.47,86.74 98.81,86.74 98.17,86.11 98.17,85.35 TO_FCC.P$5
SIG2  (via drill 0.6)
  Top 0.305: U$1.25 77.47,67.31 78.87,68.71 86.49,68.71 91.69,73.91 92.58,73.91 v92.96,74.3
  Bottom 0.305: v92.96,74.3 99.19,80.52 TO_FCC.P$6
SIG3
  Top 0.305: U$1.24 74.93,67.82 76.45,69.34 86.23,69.34 92.2,75.31 96.14,75.31 102.74,81.92 102.74,84.58 101.98,85.34 TO_FCC.P$7
SIG4
  Top 0.305: U$1.23 72.39,66.17 76.2,69.98 86.11,69.98 92.08,75.95 95.89,75.95 101.22,81.28 TO_FCC.P$8
TX
  Top 0.305: U$1.3 78.11,75.56 77.09,75.56 76.71,75.95 76.71,77.01 U2.11
TX12  (via drill 0.6)
  Top 0.305: U2.13 77.93,78.44 v78.11,78.61
  Bottom 0.305: v78.11,78.61 90.3,90.81 93.6,90.81 96.14,88.27 96.14,85.36 TO_FCC.P$3
V1  (via drill 0.51)
  Top 0.406: v2.54,35.56 2.54,78.74 5.08,81.28 26.67,81.28 32.25,75.7 0001000.11
  Bottom 0.406: U$3.1 13.97,22.86 2.54,34.29 v2.54,35.56
V2  (via drill 0.51)
  Top 0.406: v3.81,37.47 3.81,76.2 7.62,80.01 26.67,80.01 31.63,75.05 0001000.12
  Bottom 0.406: U$3.2 15.24,22.86 3.81,34.29 v3.81,37.47
V3  (via drill 0.51)
  Top 0.406: v5.08,39.37 5.08,74.93 8.89,78.74 26.67,78.74 31.01,74.4 0001000.13
  Bottom 0.406: U$3.3 16.51,22.86 5.08,34.29 v5.08,39.37
V4  (via drill 0.51)
  Top 0.406: v6.35,41.27 6.35,73.66 10.16,77.47 26.04,77.47 29.75,73.75 0001000.14
  Bottom 0.406: U$3.4 17.78,22.86 6.35,34.29 v6.35,41.27
V5  (via drill 0.51)
  Top 0.406: v7.62,43.18 7.62,72.39 11.11,75.88 R2.2
  Bottom 0.406: U$3.5 19.05,22.86 7.62,34.29 v7.62,43.18
V6  (via drill 0.51)
  Top 0.406: v8.89,45.09 8.89,71.12 11.11,73.34 R4.2
  Bottom 0.406: U$3.6 20.32,22.86 8.89,34.29 v8.89,45.09
V7  (via drill 0.51)
  Top 0.406: v10.16,46.99 10.16,68.58 11.43,69.85 19.05,69.85 20,70.8 R6.2
  Bottom 0.406: U$3.7 21.59,22.86 10.16,34.29 v10.16,46.99
V8  (via drill 0.51)
  Top 0.406: v11.43,48.9 11.43,67.31 12.38,68.26 R8.2
  Bottom 0.406: U$3.8 22.86,22.86 11.43,34.29 v11.43,48.9
V9
  Top 0.406: U$3.9 26.67,17.78 24.13,15.24 13.97,15.24 11.43,17.78 11.43,31.75 12.38,32.7 R23.2
V10
  Top 0.406: U$3.10 26.67,20.32 24.13,22.86 19.05,22.86 14.92,26.99 R21.2
V11
  Top 0.406: U$3.11 30.48,20.95 29.84,21.59 26.67,21.59 24.13,24.13 19.68,24.13 16.51,27.3 16.51,32.38 17.46,33.34 R19.2
V12
  Top 0.406: U$3.12 31.75,21.59 30.48,22.86 29.21,22.86 27.94,24.13 25.4,24.13 24.13,25.4 20.95,25.4 20,26.36 R17.2
V13
  Top 0.406: U$3.13 33.02,22.23 31.75,23.5 29.84,23.5 28.57,24.77 26.04,24.77 24.77,26.04 22.86,26.04 21.59,27.3 21.59,31.75 22.54,32.7 R15.2
V14
  Top 0.406: U$3.14 34.29,22.86 33.02,24.13 30.48,24.13 29.21,25.4 26.67,25.4 25.08,26.99 R13.2
V15
  Top 0.406: U$3.15 35.56,22.86 33.66,24.77 31.11,24.77 29.84,26.04 27.3,26.04 26.67,26.67 26.67,31.75 27.62,32.7 R11.2
V16
  Top 0.406: U$3.16 36.83,22.86 34.29,25.4 31.75,25.4 30.16,26.99 R9.2
V17
  Top 0.406: R37.2 32.7,32.7 31.75,31.75 31.75,26.67 32.38,26.04 34.92,26.04 36.2,24.77 38.73,24.77 40.01,23.5 40.64,23.5 41.91,22.23 U$3.17
V18
  Top 0.406: R35.2 35.24,26.99 36.83,25.4 39.37,25.4 40.64,24.13 41.91,24.13 43.18,22.86 U$3.18
V19
  Top 0.406: R33.2 37.78,32.7 36.83,31.75 36.83,26.67 37.47,26.04 40.01,26.04 41.27,24.77 43.81,24.77 44.45,24.13 U$3.19
V20
  Top 0.406: U$3.20 45.72,24.13 44.45,25.4 41.91,25.4 40.32,26.99 R31.2
V21
  Top 0.406: U$3.21 46.99,24.13 45.09,26.04 42.55,26.04 41.91,26.67 41.91,32.38 42.86,33.34 R29.2
V22
  Top 0.406: U$3.22 48.26,24.13 45.4,26.99 R27.2
V23
  Top 0.406: U$3.23 49.53,24.13 46.99,26.67 46.99,33.02 47.94,33.97 R25.2
V24
  Top 0.406: U$3.24 50.8,24.13 50.48,24.45 R40.2
V25
  Top 0.406: U$3.25 55.88,22.86 52.07,26.67 52.07,34.29 53.02,35.24 R55.2
V26
  Top 0.406: U$3.26 57.15,24.13 55.24,26.04 54.61,26.04 53.66,26.98 R53.2
V27
  Top 0.406: U$3.27 58.42,24.13 57.15,25.4 57.15,31.75 55.88,33.02 55.88,33.66 56.52,34.29 57.15,34.29 58.1,35.24 R51.2
V28
  Top 0.406: U$3.28 59.69,24.13 58.74,25.08 R49.2
V29
  Top 0.406: U$3.29 60.96,21.59 62.23,22.86 62.23,31.75 60.96,33.02 60.96,33.66 61.59,34.29 62.23,34.29 63.18,35.24 R42.2
V30
  Top 0.406: U$3.30 62.23,21.59 63.82,23.18 R44.2
V31
  Top 0.406: U$3.31 63.5,20.95 64.14,21.59 65.41,21.59 67.31,23.5 67.31,31.75 66.04,33.02 66.04,33.66 66.67,34.29 67.31,34.29 68.26,35.24 R46.2
V32
  Top 0.406: U$3.32 67.31,20.32 68.9,21.91 R48.2
V33
  Top 0.406: U$3.33 69.85,20.95 72.39,23.5 72.39,33.02 71.44,33.97 R71.2
V34
  Top 0.406: U$3.34 71.12,20.95 73.98,23.82 R69.2
V35
  Top 0.406: U$3.35 72.39,20.95 75.56,24.13 76.2,24.13 77.47,25.4 77.47,33.02 76.52,33.97 R67.2
V36
  Top 0.406: U$3.36 73.66,20.95 76.2,23.5 78.11,23.5 79.06,24.45 R65.2
V37
  Top 0.406: U$3.37 74.93,20.95 76.83,22.86 80.01,22.86 82.55,25.4 82.55,33.02 81.6,33.97 R58.2
V38
  Top 0.406: U$3.38 76.2,20.95 77.47,22.23 80.64,22.23 84.14,25.72 R60.2
V39
  Top 0.406: U$3.39 77.47,20.95 78.11,21.59 81.28,21.59 85.09,25.4 86.36,25.4 87.63,26.67 87.63,33.02 86.68,33.97 R62.2
V40
  Top 0.406: U$3.40 81.28,20.32 85.72,24.77 87.63,24.77 89.22,26.36 R64.2
V41
  Top 0.406: U$3.41 83.82,21.59 86.36,24.13 91.44,24.13 92.71,25.4 92.71,33.02 91.76,33.97 R83.2
V42
  Top 0.406: U$3.42 85.09,21.59 87,23.5 92.71,23.5 94.3,25.09 R81.2
V43
  Top 0.406: U$3.43 86.36,21.59 87.63,22.86 96.52,22.86 97.79,24.13 97.79,33.02 96.84,33.97 R79.2
V44
  Top 0.406: U$3.44 87.63,21.59 88.27,22.23 98.42,22.23 99.38,23.18 R77.2
V45
  Top 0.406: U$3.45 88.9,20.95 89.53,21.59 101.6,21.59 102.87,22.86 102.87,33.02 101.92,33.97 R75.2
V46
  Top 0.406: U$3.46 91.44,19.05 101.6,19.05 104.46,21.91 R73.2
V+  (via drill 0.51, 0.6)
  Top 0.305: R87.2 19.62,83.5 20.57,82.55 31.75,82.55 v35.56,78.74 | 39.37,78.74 39.37,80.52 v37.85,82.04 | 0001010.3 43.15,54.33 44.07,55.24 45.34,55.24 49.15,59.05 v53.09,59.05
  Top 0.406: 0001000.3 39.34,71.15 39.37,71.12 39.69,71.44 C1.1 C3.1 44.45,73.66 43.49,74.61 C2.1 40.95,74.61 39.87,75.7 | 0001000.10 39.87,75.7 | 0001001.3 22.83,56.87 C7.1 C8.1 20.32,59.69 19.36,58.73 C9.1 19.36,56.2 18.28,55.11 | 38.6,55.11 39.69,56.2 C16.1 39.69,58.73 40.64,59.69 C17.1 C15.1 43.15,56.87 0001010.3 0001010.4 | 38.6,55.11 0001010.10 | 0001011.4 0001011.3 62.2,56.87 C22.1 C23.1 59.69,59.69 58.73,58.73 C21.1 58.73,56.2 57.65,55.11 | 57.65,55.11 0001011.10 | 0011000.3 80.61,56.87 C28.1 C29.1 78.11,59.69 77.15,58.73 C27.1 77.15,56.2 76.06,55.11 | 76.06,55.11 0011000.10 | 0011001.3 100.94,55.27 100.02,56.2 C33.1 C35.1 98.42,60.33 97.47,59.37 C34.1 97.47,56.83 96.39,55.74 0011001.10 | U$1.20 64.77,67.31 69.85,72.39 69.85,72.77 U$1.7 | 39.87,75.7 40.64,76.47 40.64,77.47 39.37,78.74 v35.56,78.74 | 57.65,55.11 57.15,54.61 v55.88,54.61 | v74.3,53.98 74.93,53.98 76.06,55.11 | 18.28,55.11 16.64,55.11 v16.51,55.24 | v30.48,49.53 33.02,49.53 38.6,55.11 | 18.28,55.11 0001001.10 | U2.16 U2.15
  Top 0.508: 96.71,67.5 95.25,66.04 R85.2 R86.2 92.39,58.1 94.75,55.74 96.39,55.74
  Top 0.61: TO_FCC.P$1 94.08,84.94 87.38,78.23 | 87.38,78.23 v87.38,72.9 85.34,70.87 71.75,70.87 69.85,72.77 | U2.16 86.23,77.09 87.38,78.23 | v96.9,67.69 96.71,67.5
  Bottom 0.305: v37.85,82.04 37.85,82.93 38.35,83.44 40.13,83.44 40.64,83.95 ISP1.2 | v53.09,59.05 55.5,59.05 56.01,58.55
  Bottom 0.406: v74.3,53.98 72.39,52.07 57.15,52.07 55.88,53.34 v55.88,54.61 55.88,58.42 56.01,58.55 60.96,63.5 63.5,63.5 64.77,64.77 U$1.20 | v30.48,49.53 19.05,49.53 16.51,52.07 v16.51,55.24 16.51,59.69 v35.56,78.74 | U$1.7 70.93,72.58 C37.1 70.81,70.74 C38.1
  Bottom 0.61: v87.38,72.9 93.85,72.9 96.9,69.85 v96.9,67.69

### Text on the board
tPlace: UABERTA ECOCAR Cell VM BOARD | V8 | V16 | V24 | V32 | V40 | V46 | V1 | V9 | V17 | V25 | V33 | V41 | GND